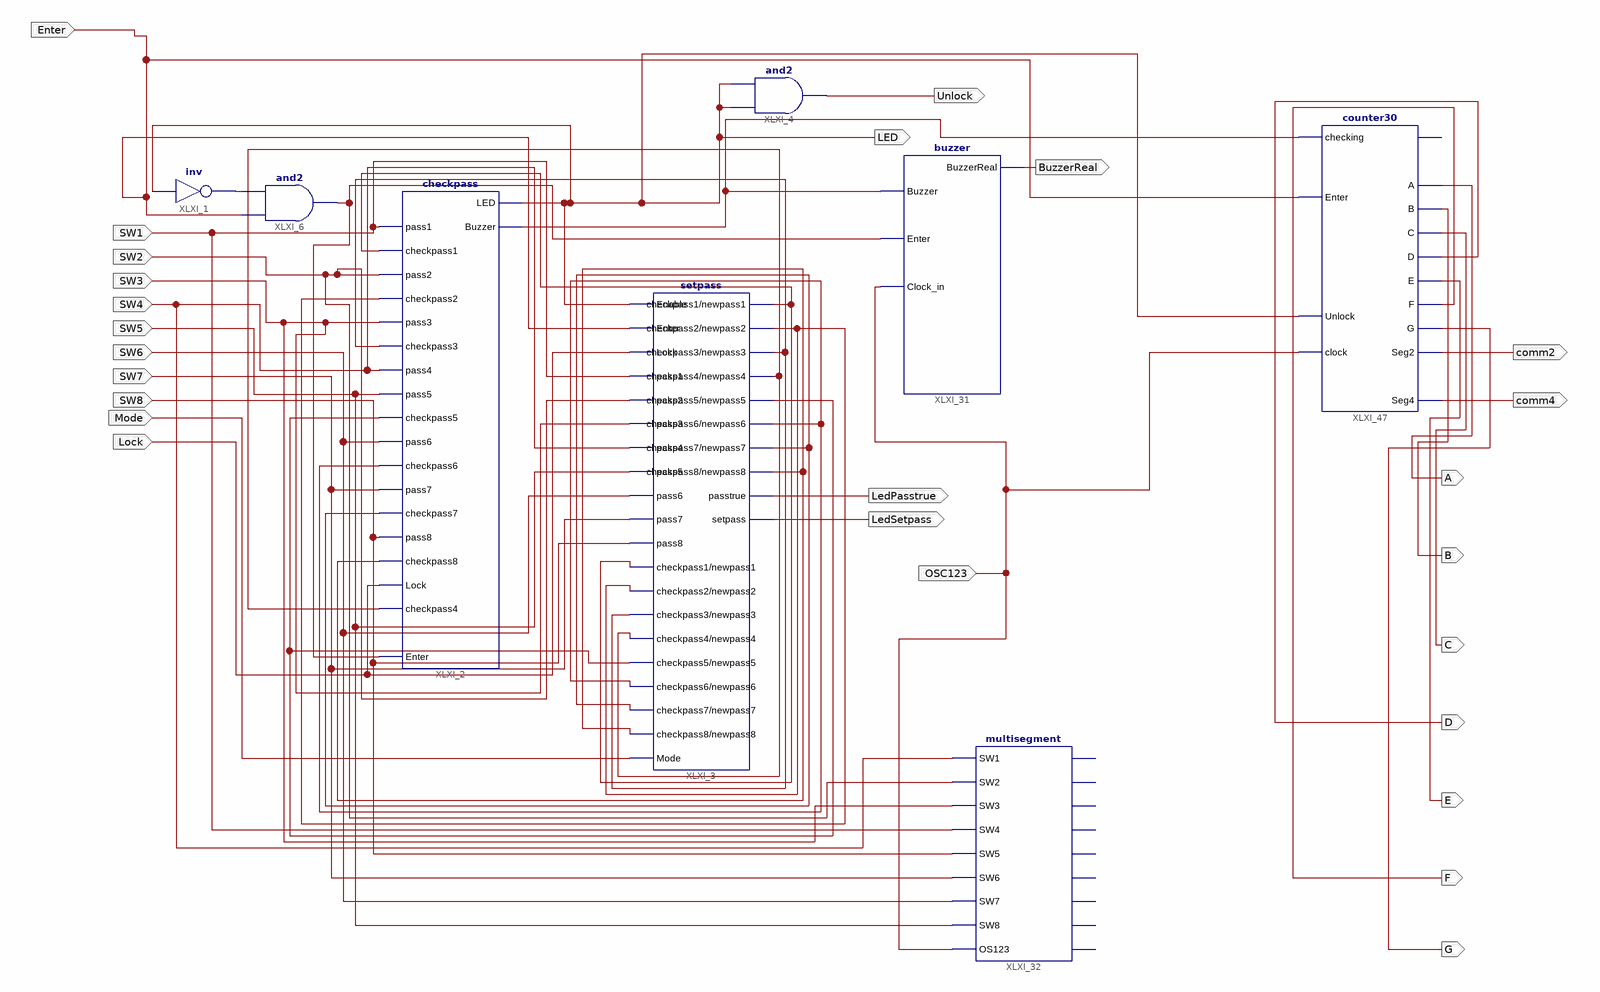
[diagram p0: schematic sheet 1]
// Xilinx ISE schematic copy.sch (spartan6) as structural Verilog: 8 symbols, 26 ports
module copy (
  input  Lock,
  input  Mode,
  input  SW1,
  input  SW4,
  input  SW5,
  input  SW6,
  input  SW7,
  input  SW8,
  input  SW2,
  input  SW3,
  input  Enter,
  input  OSC123,
  output BuzzerReal,
  output LED,
  output LedPasstrue,
  output LedSetpass,
  output Unlock,
  output A,
  output B,
  output C,
  output D,
  output E,
  output F,
  output G,
  output comm2,
  output comm4
);

  wire XLXN_2, XLXN_3, XLXN_6, XLXN_8, XLXN_10, XLXN_12, XLXN_16, XLXN_18, XLXN_89, XLXN_107, XLXN_109;

  not XLXI_1 (XLXN_3, LED);
  checkpass XLXI_2 (
    .Lock(Lock), .pass1(SW1), .checkpass1(XLXN_16), .pass2(SW2), .checkpass2(XLXN_6), .pass3(SW3),
    .checkpass3(XLXN_107), .pass4(SW4), .checkpass4(XLXN_18), .pass5(SW5), .checkpass5(XLXN_89), .pass6(SW6),
    .checkpass6(XLXN_12), .pass7(SW7), .checkpass7(XLXN_10), .pass8(SW8), .checkpass8(XLXN_8),
    .Enter(XLXN_109), .LED(LED), .Buzzer(XLXN_2));
  setpass XLXI_3 (
    .checkpass1(XLXN_16), .checkpass2(XLXN_6), .checkpass3(XLXN_107), .checkpass4(XLXN_18),
    .checkpass5(XLXN_89), .checkpass6(XLXN_12), .checkpass7(XLXN_10), .checkpass8(XLXN_8), .Enable(LED),
    .Enter(Enter), .Lock(Lock), .Mode(Mode), .newpass1(XLXN_16), .newpass2(XLXN_6), .newpass3(XLXN_107),
    .newpass4(XLXN_18), .newpass5(XLXN_89), .newpass6(XLXN_12), .newpass7(XLXN_10), .newpass8(XLXN_8),
    .pass1(SW1), .pass2(SW2), .pass3(SW3), .pass4(SW4), .pass5(SW5), .pass6(SW6), .pass7(SW7), .pass8(SW8),
    .passtrue(LedPasstrue), .setpass(LedSetpass));
  and XLXI_4 (Unlock, LED, LED);
  buzzer XLXI_31 (.Buzzer(XLXN_2), .Enter(XLXN_109), .Clock_in(OSC123), .BuzzerReal(BuzzerReal));
  and XLXI_6 (XLXN_109, Enter, XLXN_3);
  multisegment XLXI_32 (
    .SW1(SW4), .SW2(SW2), .SW3(SW3), .SW4(SW1), .SW5(SW8), .SW6(SW7), .SW7(SW6), .SW8(SW5), .OS123(OSC123));  // open: A, B, C, D, E, F, G, common1, common0
  counter30 XLXI_47 (
    .checking(XLXN_2), .Enter(Enter), .Unlock(LED), .clock(OSC123), .Seg4(comm4), .A(A), .B(B), .C(C), .D(D),
    .E(E), .F(F), .G(G), .Seg2(comm2));  // open: AllowEnter

  // Notes on the sheet:
  //   LOC on signal LED = Minor
endmodule
